# Altium schematic sheet Sheet1.SchDoc
size C
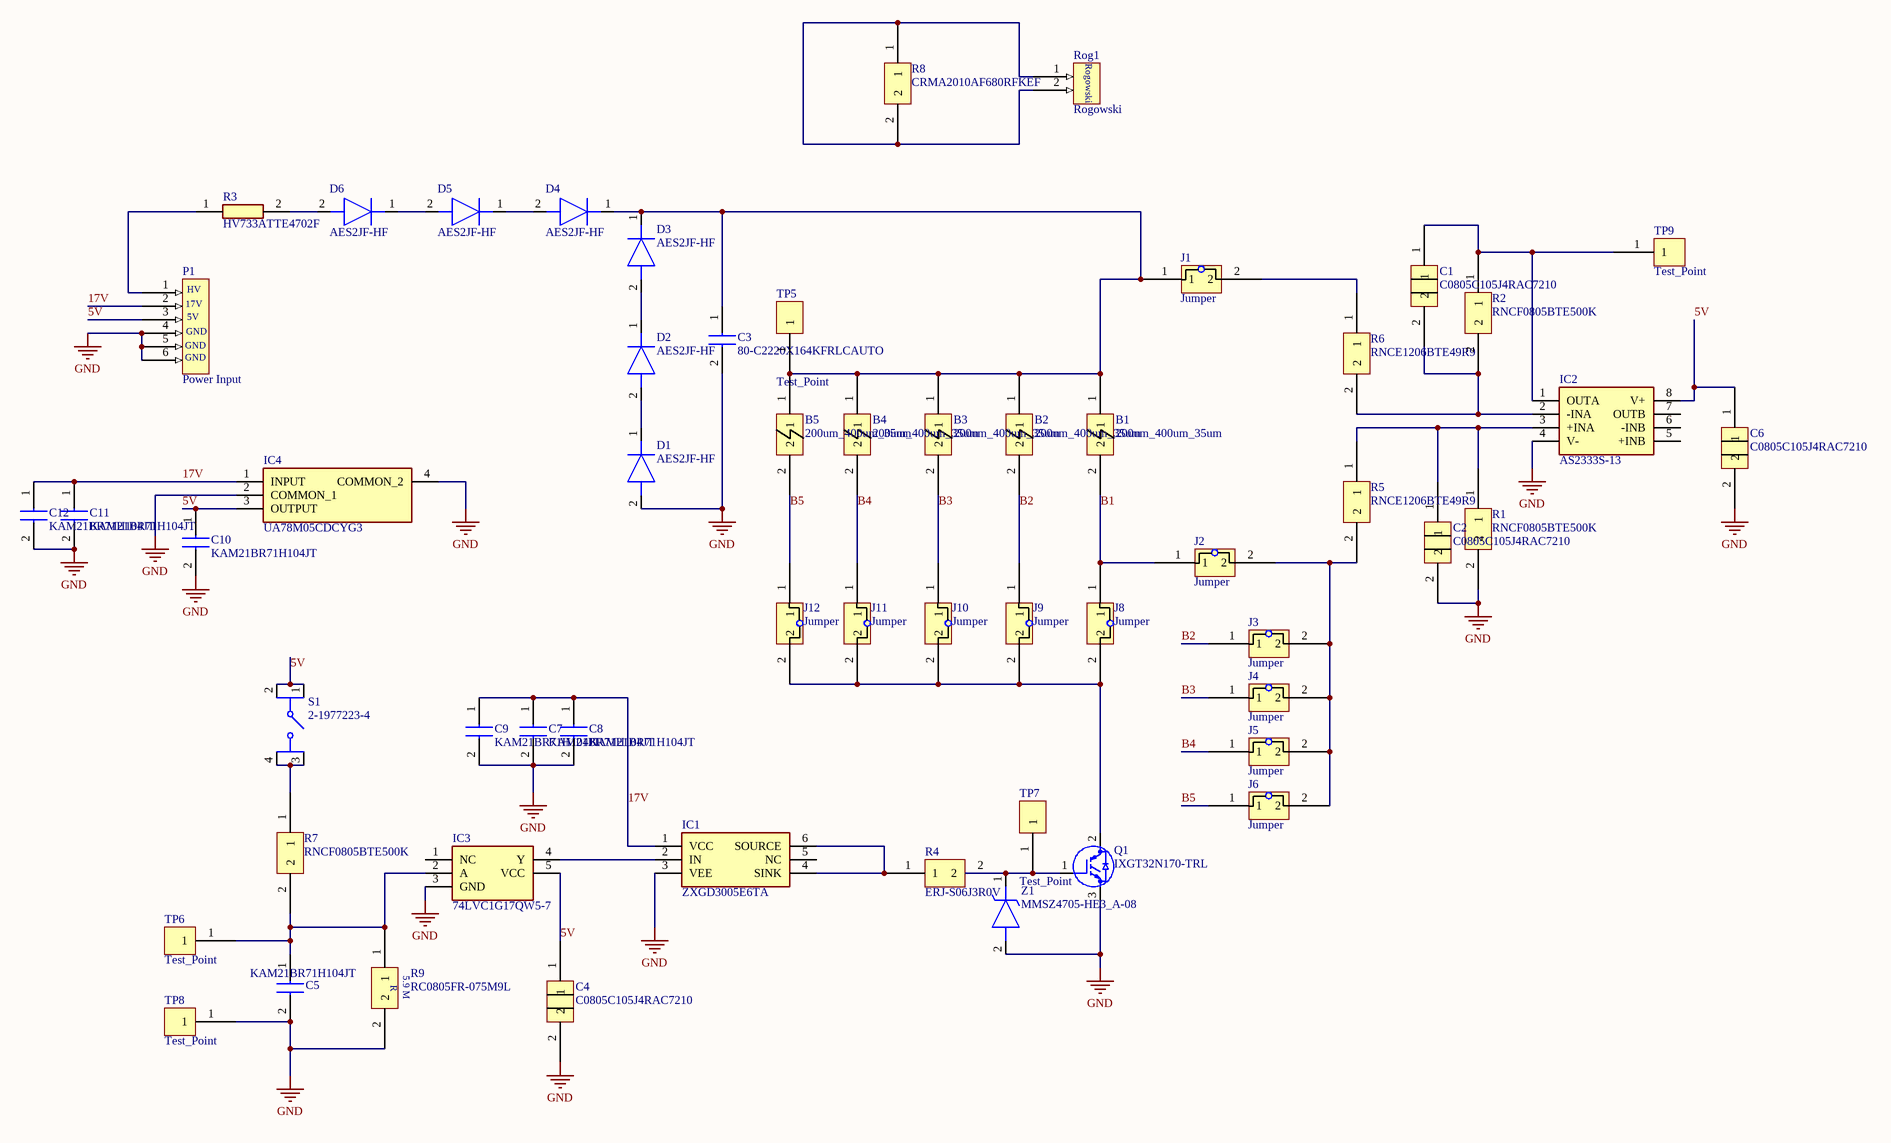
[diagram p0: Sheet1.SchDoc]

## Parts
B1  200um_400um_35um  [Bridge_2]
B2  200um_400um_35um  [Bridge_2]
B3  200um_400um_35um  [Bridge_2]
B4  200um_400um_35um  [Bridge_2]
B5  200um_400um_35um  [Bridge_2]
C1  C0805C105J4RAC7210  [RESC2012X60N]
C2  C0805C105J4RAC7210  [RESC2012X60N]
C3  80-C2220X164KFRLCAUTO  [CAPC5750X280N]
C4  C0805C105J4RAC7210  [RESC2012X60N]
C5  KAM21BR71H104JT  [CAPC2012X94N]
C6  C0805C105J4RAC7210  [RESC2012X60N]
C7  KAM21BR71H104JT  [CAPC2012X94N]
C8  KAM21BR71H104JT  [CAPC2012X94N]
C9  KAM21BR71H104JT  [CAPC2012X94N]
C10  KAM21BR71H104JT  [CAPC2012X94N]
C11  KAM21BR71H104JT  [CAPC2012X94N]
C12  KAM21BR71H104JT  [CAPC2012X94N]
D1  AES2JF-HF  [SODFL5226X110N]
D2  AES2JF-HF  [SODFL5226X110N]
D3  AES2JF-HF  [SODFL5226X110N]
D4  AES2JF-HF  [SODFL5226X110N]
D5  AES2JF-HF  [SODFL5226X110N]
D6  AES2JF-HF  [SODFL5226X110N]
IC1  ZXGD3005E6TA  [SOT95P285X140-6N]
IC2  AS2333S-13  [SOIC127P600X150-8N]
IC3  74LVC1G17QW5-7  [SOT95P285X140-5N]
IC4  UA78M05CDCYG3  [SOT230P700X180-4N]
J1  Jumper  [Jumper]
J2  Jumper  [Jumper]
J3  Jumper  [Jumper]
J4  Jumper  [Jumper]
J5  Jumper  [Jumper]
J6  Jumper  [Jumper]
J8  Jumper  [Jumper]
J9  Jumper  [Jumper]
J10  Jumper  [Jumper]
J11  Jumper  [Jumper]
J12  Jumper  [Jumper]
P1  Power Input  [Power Input]
Q1  IXGT32N170-TRL  [IXGT32N170TRL]
R1  RNCF0805BTE500K  [RESC2012X60N]
R2  RNCF0805BTE500K  [RESC2012X60N]
R3  HV733ATTE4702F  [RESC6331X70N]
R4  ERJ-S06J3R0V  [RESC2012X60N]
R5  RNCE1206BTE49R9  [RESC3216X60N]
R6  RNCE1206BTE49R9  [RESC3216X60N]
R7  RNCF0805BTE500K  [RESC2012X60N]
R8  CRMA2010AF680RFKEF  [RESC3216X65N]
R9  RC0805FR-075M9L  [RESC2012X60N]
Rog1  Rogowski  [Rogowski]
S1  2-1977223-4  [219772234]
TP5  Test_Point  [TestPoint]
TP6  Test_Point  [TestPoint]
TP7  Test_Point  [TestPoint]
TP8  Test_Point  [TestPoint]
TP9  Test_Point  [TestPoint]
Z1  MMSZ4705-HE3_A-08  [SOD3716X135N]

## Nets
GND: C2.2 C3.2 C4.2 C5.2 C6.2 C7.2 C8.2 C9.2 C10.2 C11.2 C12.2 D1.2(A) IC1.3(VEE) IC2.4(V-) IC3.3(GND) IC4.2(COMMON_1) IC4.4(COMMON_2) P1.4 P1.5 P1.6 Q1.3(E) R1.2 R9.2 TP8.1 Z1.2(A)
5V: C4.1 C6.1 C10.1 IC2.8(V+) IC3.5(VCC) IC4.3(OUTPUT) P1.3 S1.1(COM_1) S1.2(COM_2)
17V: C7.1 C8.1 C9.1 C11.1 C12.1 IC1.1(VCC) IC4.1(INPUT) P1.2
B1: B1.2 J2.1 J8.1
B2: B2.2 J3.1 J9.1
B3: B3.2 J4.1 J10.1
B4: B4.2 J5.1 J11.1
B5: B5.2 J6.1 J12.1
NetB1_1: B1.1 B2.1 B3.1 B4.1 B5.1 C3.1 D3.1(K) D4.1(K) J1.1 TP5.1
NetC1_1: C1.1 IC2.1(OUTA) R2.1 TP9.1
NetC1_2: C1.2 IC2.2(-INA) R2.2 R6.2
NetC2_1: C2.1 IC2.3(+INA) R1.1 R5.1
NetC5_1: C5.1 IC3.2(A) R7.2 R9.1 TP6.1
NetD1_1: D1.1(K) D2.2(A)
NetD2_1: D2.1(K) D3.2(A)
NetD4_2: D4.2(A) D5.1(K)
NetD5_2: D5.2(A) D6.1(K)
NetD6_2: D6.2(A) R3.2
NetIC1_2: IC1.2(IN) IC3.4(Y)
NetIC1_4: IC1.4(SINK) IC1.6(SOURCE) R4.1
NetJ1_2: J1.2 R6.1
NetJ2_2: J2.2 J3.2 J4.2 J5.2 J6.2 R5.2
NetJ8_2: J8.2 J9.2 J10.2 J11.2 J12.2 Q1.2(C)
NetP1_1: P1.1 R3.1
NetQ1_1: Q1.1(G) R4.2 TP7.1 Z1.1(K)
NetR7_1: R7.1 S1.3(NO_1) S1.4(NO_2)
NetR8_1: R8.1 R8.2 Rog1.1 Rog1.2

Not connected (* = marked no-connect by the designer): IC1 5(NC); IC2 5(+INB) 6(-INB) 7(OUTB); IC3 1(NC)

## Notes on the sheet
- (in symbol 5.9MOhm Res) 5.9 M; R
- (in symbol Power Input) HV; 17V; 5V; GND

## Library data of the parts
B1-B5 = Bridge_2
C1 C2 C4 C6 = 1u 10V: 0805 Ceramic
C3 = 80-C2220X164KFRLCAUTO: 0.16uF / 1500V
C5 C7-C12 = KAM21BR71H104JT: Capacitor; Manufacturer_Name: Kyocera AVX; Datasheet Link: https://spicat.kyocera-avx.com/product/mlcc/chartview/KAM21BR71H104JT/DataSheet/X7R; Height: 0.94mm; Manufacturer_Part_Number: KAM21BR71H104JT; Mouser Part Number: 581-KAM21BR71H104JT; Mouser Price/Stock: https://www.mouser.co.uk/ProductDetail/KYOCERA-AVX/KAM21BR71H104JT?qs=Jm2GQyTW%2Fbic6Zk4McEt6w%3D%3D; Arrow Part Number: KAM21BR71H104JT; Arrow Price/Stock: https://www.arrow.com/en/products/kam21br71h104jt/avx?utm_currency=USD&region=nac
D1-D6 = AES2JF-HF: Diode; Manufacturer_Name: Comchip Technology; Datasheet Link: https://www.comchiptech.com/admin/files/product/20190826114642.PDF; Height: 1.1mm; Manufacturer_Part_Number: AES2JF-HF; Mouser Part Number: 750-AES2JF-HF; Mouser Price/Stock: https://www.mouser.co.uk/ProductDetail/Comchip-Technology/AES2JF-HF?qs=GBLSl2Akirug3Evn59Vm1Q%3D%3D; Arrow Part Number: AES2JF-HF; Arrow Price/Stock: https://www.arrow.com/en/products/aes2jf-hf/comchip-technology?region=nac
IC1 = ZXGD3005E6TA: Integrated Circuit; Manufacturer_Name: Diodes Incorporated; Datasheet Link: https://www.diodes.com//assets/Datasheets/ZXGD3005E6.pdf; Height: 1.4mm; Manufacturer_Part_Number: ZXGD3005E6TA; Mouser Part Number: 522-ZXGD3005E6TA; Mouser Price/Stock: https://www.mouser.co.uk/ProductDetail/Diodes-Incorporated/ZXGD3005E6TA?qs=mM5ZU9tM8NelwnPGVh4qtQ%3D%3D; Arrow Part Number: ZXGD3005E6TA; Arrow Price/Stock: https://www.arrow.com/en/products/zxgd3005e6ta/diodes-incorporated?region=nac
IC2 = AS2333S-13: Integrated Circuit; Manufacturer_Name: Diodes Incorporated; Datasheet Link: https://www.diodes.com/assets/Datasheets/AS2333.pdf; Height: 1.5mm; Manufacturer_Part_Number: AS2333S-13; Mouser Part Number: 621-AS2333S-13; Mouser Price/Stock: https://www.mouser.co.uk/ProductDetail/Diodes-Incorporated/AS2333S-13?qs=sPbYRqrBIVls8seEy2CWjg%3D%3D; Arrow Part Number: AS2333S-13; Arrow Price/Stock: https://www.arrow.com/en/products/as2333s-13/diodes-incorporated?utm_currency=USD&region=nac
IC3 = 74LVC1G17QW5-7: Integrated Circuit; Manufacturer_Name: Diodes Incorporated; Datasheet Link: https://www.diodes.com//assets/Datasheets/74LVC1G17Q.pdf; Height: 1.4mm; Manufacturer_Part_Number: 74LVC1G17QW5-7; Mouser Part Number: 621-74LVC1G17QW5-7; Mouser Price/Stock: https://www.mouser.co.uk/ProductDetail/Diodes-Incorporated/74LVC1G17QW5-7?qs=sPbYRqrBIVng3b7ZXxamXA%3D%3D; Arrow Part Number: 74LVC1G17QW5-7; Arrow Price/Stock: https://www.arrow.com/en/products/74lvc1g17qw5-7/diodes-incorporated?region=europe
IC4 = UA78M05CDCYG3: Integrated Circuit; Manufacturer_Name: Texas Instruments; Datasheet Link: https://www.ti.com/lit/ds/symlink/ua78m.pdf?ts=1600084265750&ref_url=https%253A%252F%252Fwww.google.com%252F; Height: 1.8mm; Manufacturer_Part_Number: UA78M05CDCYG3; Mouser Part Number: 595-UA78M05CDCYG3; Mouser Price/Stock: https://www.mouser.co.uk/ProductDetail/Texas-Instruments/UA78M05CDCYG3?qs=0O%2FZFlpUpJW6iQLlsjczIw%3D%3D; Arrow Part Number: UA78M05CDCYG3; Arrow Price/Stock: https://www.arrow.com/en/products/ua78m05cdcyg3/texas-instruments
Q1 = IXGT32N170-TRL: Transistor IGBT; Manufacturer_Name: LITTELFUSE; Datasheet Link: http://ixapps.ixys.com/DataSheet/98941.pdf; Height: 5.1mm; Manufacturer_Part_Number: IXGT32N170-TRL; Mouser Part Number: 747-IXGT32N170-TRL; Mouser Price/Stock: https://www.mouser.co.uk/ProductDetail/IXYS/IXGT32N170-TRL?qs=uwxL4vQweFPnCXDYRbLwWw%3D%3D
R1 R2 R7 = 500k 0.1%
R3 = HV733ATTE4702F: 47k 3kV 1W; Manufacturer_Name: KOA Speer; Datasheet Link: https://www.mouser.com/datasheet/2/219/HV73-11287.pdf; Height: 0.7mm; Manufacturer_Part_Number: HV733ATTE4702F
R4 = 3 Ohm Res: 3 Ohm 125mW 0805 (2012)
R5 R6 = 49.9 Ohm 0.1%
R8 = 680 Ohm 2kV: 500mW 1%
R9 = 5.9MOhm Res: 1% 1/8W
S1 = 2-1977223-4: Switch (4-Pin Push); Manufacturer_Name: TE Connectivity; Datasheet Link: https://www.te.com/en/product-2-1977223-4.html; Height: 9.85mm; Manufacturer_Part_Number: 2-1977223-4; Mouser Part Number: 506-2-1977223-4; Mouser Price/Stock: https://www.mouser.co.uk/ProductDetail/TE-Connectivity-Alcoswitch/2-1977223-4?qs=WwRK9Mn48WApgvYrqfKzDA%3D%3D; Arrow Part Number: 2-1977223-4; Arrow Price/Stock: https://www.arrow.com/en/products/2-1977223-4/te-connectivity?region=europe
Z1 = MMSZ4705-HE3_A-08: 18V Zener Diode; Manufacturer_Name: Vishay; Datasheet Link: https://www.vishay.com/docs/86343/mmsz4681_to_mmsz4717.pdf; Height: 1.35mm; Manufacturer_Part_Number: MMSZ4705-HE3_A-08; Mouser Part Number: 78-MMSZ4705-HE3_A-08; Mouser Price/Stock: https://www.mouser.co.uk/ProductDetail/Vishay/MMSZ4705-HE3_A-08?qs=Imq1NPwxi77ZSt3OXgfKjA%3D%3D